# Altium project mu100-dit.PrjPcb
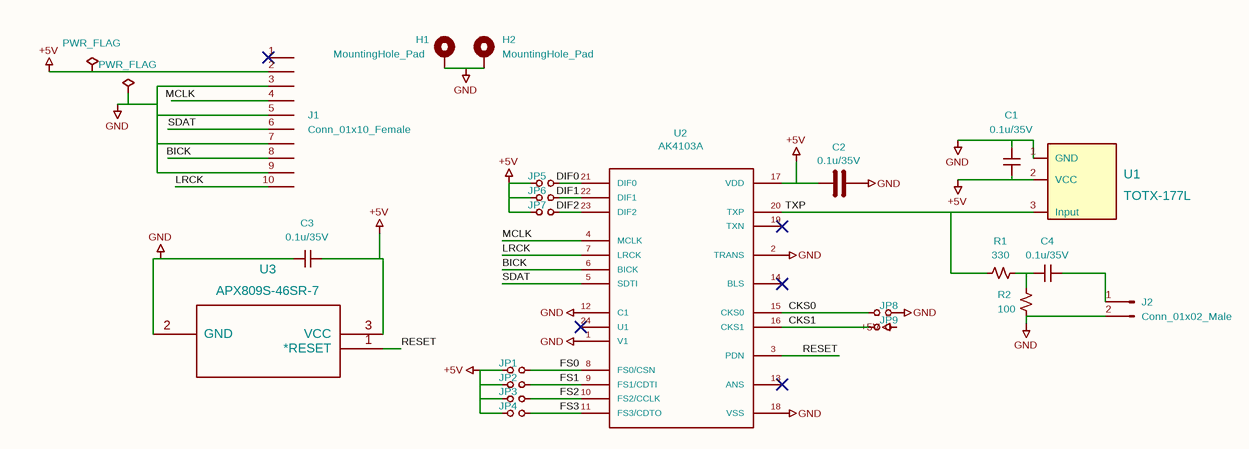
[diagram p0: mu100-dit.SchDoc]
1 sheet, 24 parts. Net scope: global (net labels, ports and power ports of the same name join across sheets).
Board files: mu100-dit.PcbDoc, mu100-dit(1).PcbDoc

## Sheet mu100-dit.SchDoc
size 297 x 209 mm

### Parts
#FLG0103  PWR_FLAG  (graphical)
#FLG0104  PWR_FLAG  (graphical)
C1  0.1u/35V  [C_0805_2012Metric_Pad1.18x1.45mm_HandSolder]
C2  0.1u/35V  [C_0805_2012Metric_Pad1.18x1.45mm_HandSolder]
C3  0.1u/35V  [C_0805_2012Metric_Pad1.18x1.45mm_HandSolder]
C4  0.1u/35V  [C_0805_2012Metric_Pad1.18x1.45mm_HandSolder]
H1  MountingHole_Pad  [MountingHole_3.2mm_M3_ISO7380_Pad_TopBottom]
H2  MountingHole_Pad  [MountingHole_3.2mm_M3_ISO7380_Pad_TopBottom]
J1  Conn_01x10_Female  [JST_PH_B10B-PH-K_1x10_P2.00mm_Vertical]
J2  Conn_01x02_Male  [PinHeader_1x02_P2.54mm_Vertical]
JP1  Jumper_NO_Small  [SolderJumper-Open_RoundedPad-custom]  (value not drawn)
JP2  Jumper_NO_Small  [SolderJumper-Open_RoundedPad-custom]  (value not drawn)
JP3  Jumper_NO_Small  [SolderJumper-Open_RoundedPad-custom]  (value not drawn)
JP4  Jumper_NO_Small  [SolderJumper-Open_RoundedPad-custom]  (value not drawn)
JP5  Jumper_NO_Small  [SolderJumper-Open_RoundedPad-custom]  (value not drawn)
JP6  Jumper_NO_Small  [SolderJumper-Open_RoundedPad-custom]  (value not drawn)
JP7  Jumper_NO_Small  [SolderJumper-Open_RoundedPad-custom]  (value not drawn)
JP8  Jumper_NO_Small  [SolderJumper-Open_RoundedPad-custom]  (value not drawn)
JP9  Jumper_NO_Small  [SolderJumper-Open_RoundedPad-custom]  (value not drawn)
R1  330  [R_0805_2012Metric_Pad1.20x1.40mm_HandSolder]
R2  100  [R_0805_2012Metric_Pad1.20x1.40mm_HandSolder]
U1  TOTX-177L  [Toshiba_TOTX177]
U2  AK4103A  [TSSOP-24_6.1x7.8mm_P0.65mm]
U3  APX809S-46SR-7  [APX809S-46SA-7]

### Nets
+5V: #FLG0103.1(pwr) C1.2 C2.2 C3.2 J1.2(Pin_2) JP1.1 JP2.1 JP3.1 JP4.1 JP5.1 JP6.1 JP7.1 JP9.1 U1.2(VCC) U2.17(VDD) U3.3(VCC)
GND: #FLG0104.1(pwr) C1.1 C2.1 C3.1 H1.1 H2.1 J1.3(Pin_3) J1.5(Pin_5) J1.7(Pin_7) J1.9(Pin_9) J2.2(Pin_2) JP8.1 R2.1 U1.1(GND) U2.1(V1) U2.2(TRANS) U2.12(C1) U2.18(VSS) U3.2(GND)
BICK: J1.8(Pin_8) U2.6(BICK)
CKS0: JP8.2 U2.15(CKS0)
CKS1: JP9.2 U2.16(CKS1)
DIF0: JP5.2 U2.21(DIF0)
DIF1: JP6.2 U2.22(DIF1)
DIF2: JP7.2 U2.23(DIF2)
FS0: JP1.2 U2.8(FS0/CSN)
FS1: JP2.2 U2.9(FS1/CDTI)
FS2: JP3.2 U2.10(FS2/CCLK)
FS3: JP4.2 U2.11(FS3/CDTO)
LRCK: J1.10(Pin_10) U2.7(LRCK)
MCLK: J1.4(Pin_4) U2.4(MCLK)
RESET: U2.3(PDN) U3.1(*RESET)
SDAT: J1.6(Pin_6) U2.5(SDTI)
TXP: R1.1 U1.3(Input) U2.20(TXP)
NetC4_1: C4.1 R1.2 R2.2
NetC4_2: C4.2 J2.1(Pin_1)

Not connected (* = marked no-connect by the designer): J1 1(Pin_1)*; U2 13(ANS)* 14(BLS)* 19(TXN)* 24(U1)*

### Notes on the sheet
- 1
- 2
- 3
- 4
- 5
- 6
- A
- B
- C
- D
- Title:
- File: mu100-dit.kicad_sch
- Sheet: /
- KiCad E.D.A.  kicad (5.1.4)-1
- Size: A4
- Date:
- Rev:
- Id: 1/1

### Library data of the parts
C1 C3 C4 = C_Small: Value: 0.1u/35V; Footprint: Capacitor_SMD:C_0805_2012Metric_Pad1.18x1.45mm_HandSolder
C2 = C: Value: 0.1u/35V; Footprint: Capacitor_SMD:C_0805_2012Metric_Pad1.18x1.45mm_HandSolder
R1 R2 = R_Small_US: Footprint: Resistor_SMD:R_0805_2012Metric_Pad1.20x1.40mm_HandSolder
  R1: Value: 330
  R2: Value: 100
U1 = totx177: Value: TOTX-177L; Footprint: footprints:Toshiba_TOTX177
#FLG0103 #FLG0104 = PWR_FLAG: Value: PWR_FLAG
H1 H2 = MountingHole_Pad: Value: MountingHole_Pad; Footprint: MountingHole:MountingHole_3.2mm_M3_ISO7380_Pad_TopBottom
J1 = Conn_01x10_Female: Value: Conn_01x10_Female; Footprint: Connector_JST:JST_PH_B10B-PH-K_1x10_P2.00mm_Vertical
J2 = Conn_01x02_Male: Value: Conn_01x02_Male; Footprint: Connector_PinHeader_2.54mm:PinHeader_1x02_P2.54mm_Vertical
JP1-JP9 = Jumper_NO_Small: Value: Jumper_NO_Small; Footprint: footprints:SolderJumper-Open_RoundedPad-custom
U2 = AK4103A: Value: AK4103A; Footprint: Package_SO:TSSOP-24_6.1x7.8mm_P0.65mm
U3 = APX809S-46SR-7: Value: APX809S-46SR-7; Footprint: APX809S:APX809S-46SA-7